# EAGLE design MF_badge_2021_rev_D (EAGLE 9.6.2)
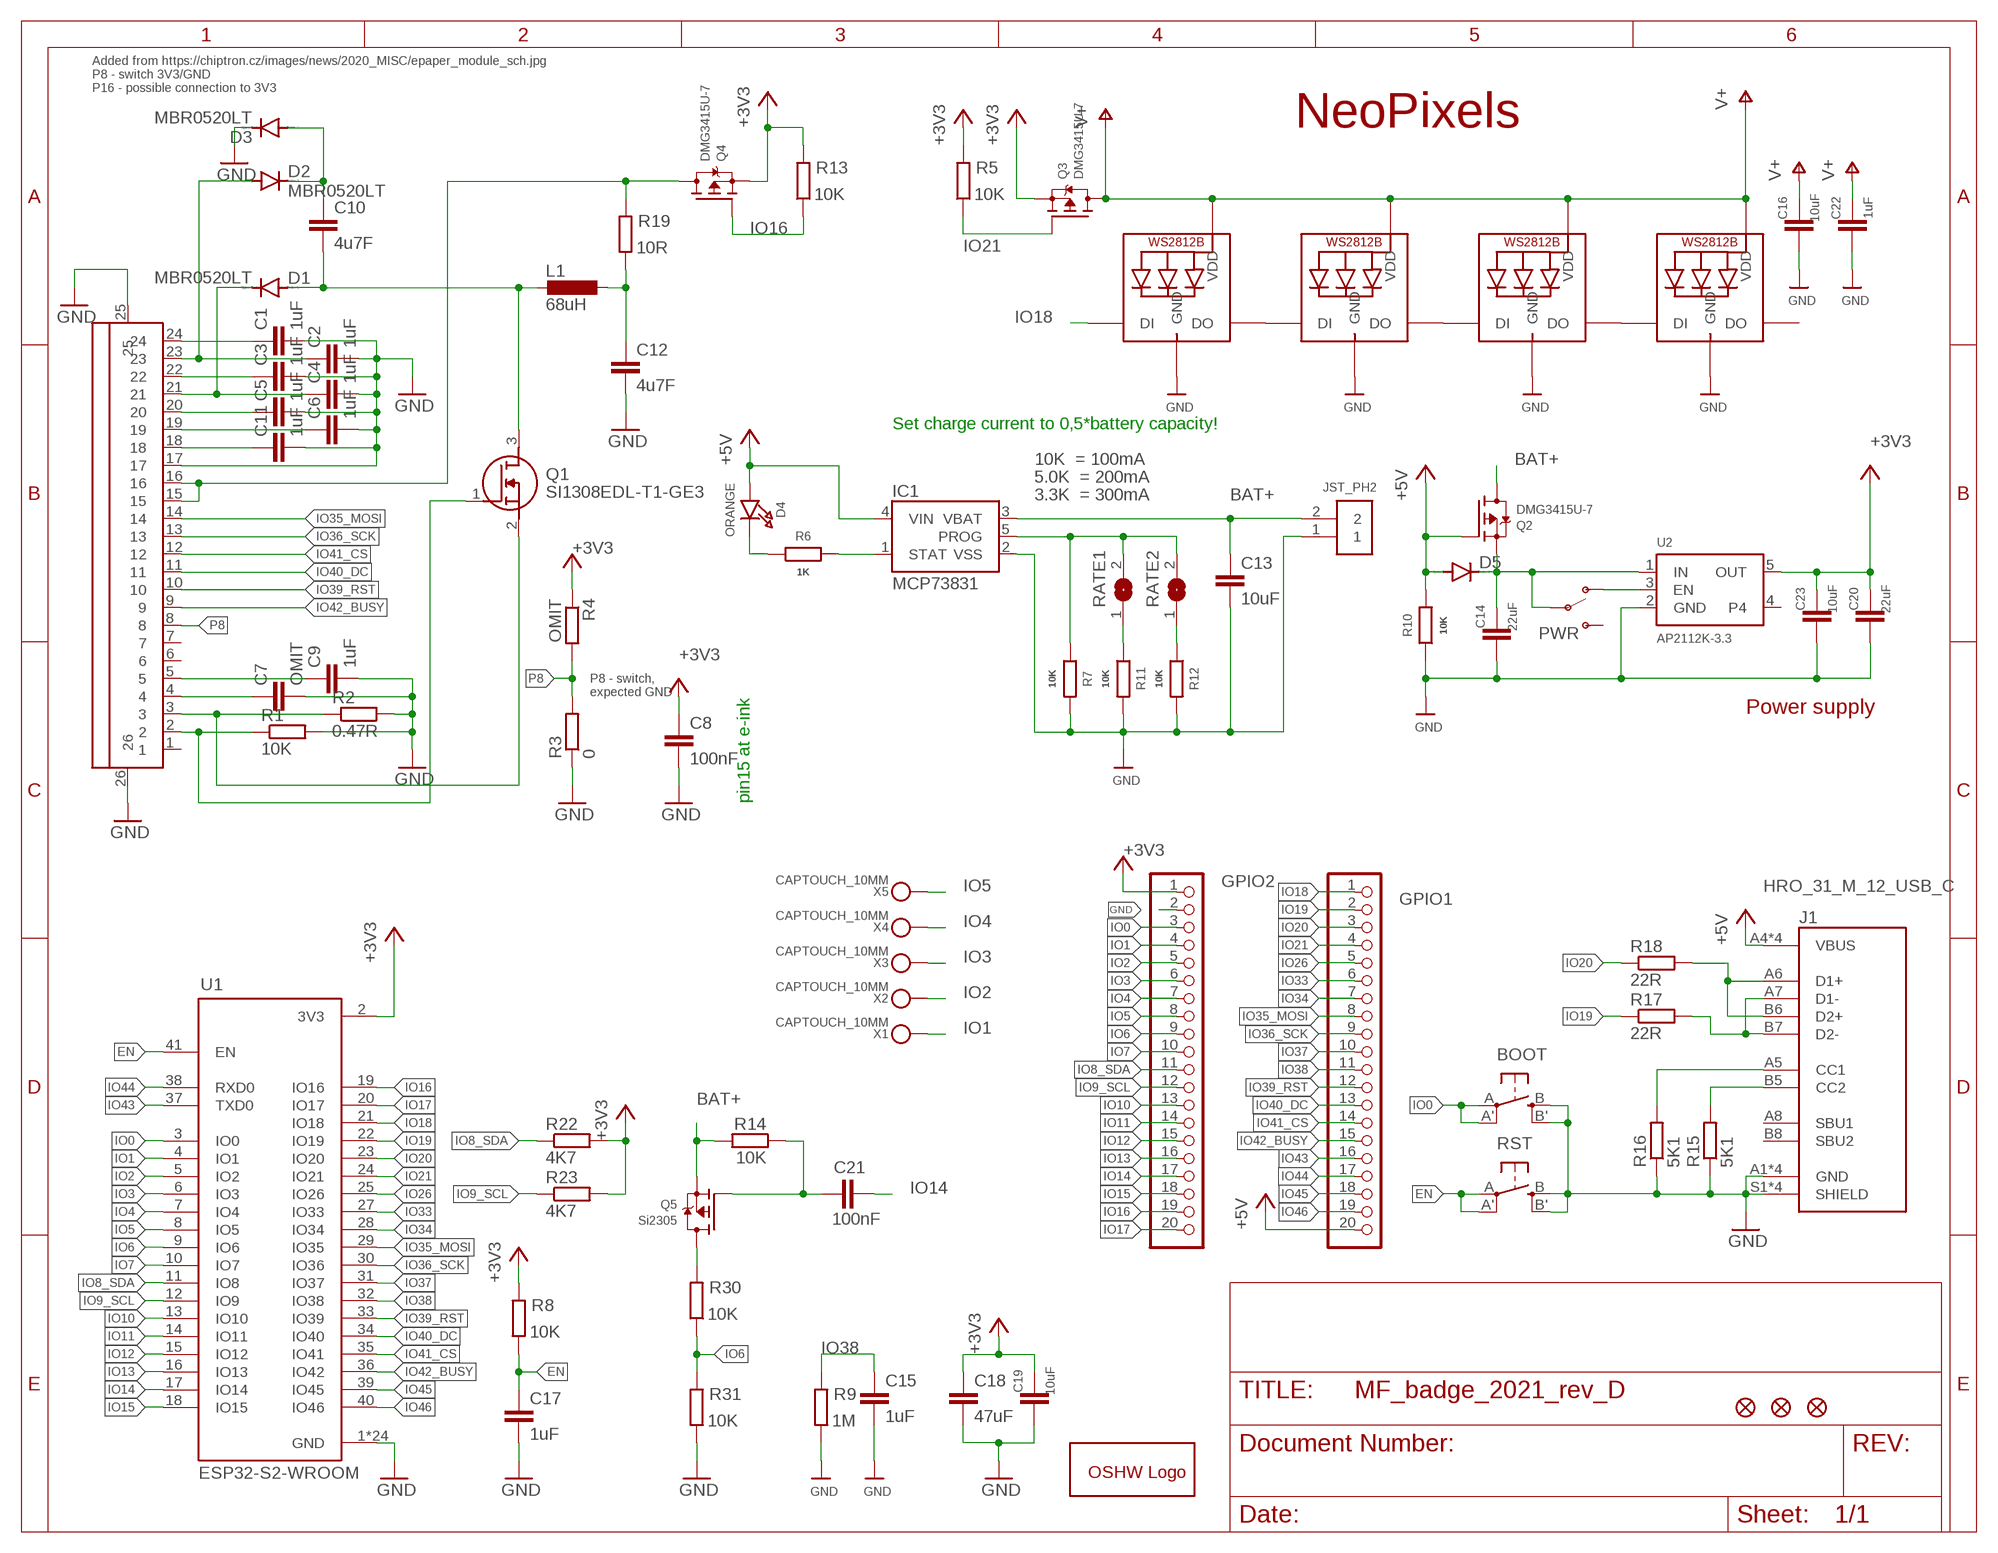
[diagram p0: schematic, sheet 1]

## Parts
BOOT  BUTTON_KMR2_4.6X2.8  [BUTTON_KMR2_4.6X2.8]
C1  1uF  C-EUC0805  [C0805]
C2  1uF  C-EUC0805  [C0805]
C3  1uF  C-EUC0805  [C0805]
C4  1uF  C-EUC0805  [C0805]
C5  1uF  C-EUC0805  [C0805]
C6  1uF  C-EUC0805  [C0805]
C7  OMIT  C-EUC0805  [C0805]
C8  100nF  C-EUC0805  [C0805]
C9  1uF  C-EUC0805  [C0805]
C10  4u7F  C-EUC0805  [C0805]
C11  1uF  C-EUC0805  [C0805]
C12  4u7F  C-EUC0805  [C0805]
C13  10uF  C-EUC0805  [C0805]
C14  22uF  C-EUC0805  [C0805]
C15  1uF  C-EUC0805  [C0805]
C16  10uF  C-EUC0805  [C0805]
C17  1uF  C-EUC0805  [C0805]
C18  47uF  C-EUC0805  [C0805]
C19  10uF  C-EUC0805  [C0805]
C20  22uF  C-EUC0805  [C0805]
C21  100nF  C-EUC0805  [C0805]
C22  1uF  C-EUC0805  [C0805]
C23  10uF  C-EUC0805  [C0805]
D1  MBR0520LT  [SOD123]
D2  MBR0520LT  [SOD123]
D3  MBR0520LT  [SOD123]
D4  ORANGE  LED0805_NOOUTLINE  [CHIPLED_0805_NOOUTLINE]
D5  MBR0520LT  [SOD123]
FID1  FIDUCIAL""  [FIDUCIAL_1MM]
FID2  FIDUCIAL""  [FIDUCIAL_1MM]
FID3  FIDUCIAL""  [FIDUCIAL_1MM]
GOLD_ORB_SM1  OSHWLOGO_  [OSHW_5MM_LOGO]
GPIO1  PINHD-1X20  [1X20]
GPIO2  PINHD-1X20  [1X20]
IC1  MCP73831  [SOT95P290X120-5]
J1  HRO_31_M_12_USB_C  [HRO_31_M_12_USB_C]
L1  68uH  L-EUL4532P  [L4532P]
LED2  WS2812B5050  [WS2812B]
LED3  WS2812B5050  [WS2812B]
LED4  WS2812B5050  [WS2812B]
LED5  WS2812B5050  [WS2812B]
PWR  SWITCH-SPDT-SMD-RIGHT-ANGLE  [SWITCH_SPST_SMD_A]
Q1  SI1308EDL-T1-GE3  [SOT65P210X110-3N]
Q2  DMG3415U-7  MOSFET-P  [SOT23-R]
Q3  DMG3415U-7  MOSFET-P  [SOT23-R]
Q4  DMG3415U-7  MOSFET-P  [SOT23-R]
Q5  Si2305  MOSFET-P  [SOT23-R]
R1  10K  R-EU_R0805  [R0805]
R2  0.47R  R-EU_R0805  [R0805]
R3  0  R-EU_R0805  [R0805]
R4  OMIT  R-EU_R0805  [R0805]
R5  10K  R-EU_R0805  [R0805]
R6  1K  R-EU_R0805  [R0805]
R7  10K  R-EU_R0805  [R0805]
R8  10K  R-EU_R0805  [R0805]
R9  1M  R-EU_R0805  [R0805]
R10  10K  R-EU_R0805  [R0805]
R11  10K  R-EU_R0805  [R0805]
R12  10K  R-EU_R0805  [R0805]
R13  10K  R-EU_R0805  [R0805]
R14  10K  R-EU_R0805  [R0805]
R15  5K1  R-EU_R0805  [R0805]
R16  5K1  R-EU_R0805  [R0805]
R17  22R  R-EU_R0805  [R0805]
R18  22R  R-EU_R0805  [R0805]
R19  10R  R-EU_R0805  [R0805]
R22  4K7  R-EU_R0805  [R0805]
R23  4K7  R-EU_R0805  [R0805]
R30  10K  R-EU_R0805  [R0805]
R31  10K  R-EU_R0805  [R0805]
RATE1  SOLDERJUMPER  [SOLDERJUMPER_ARROW_NOPASTE]
RATE2  SOLDERJUMPER  [SOLDERJUMPER_ARROW_NOPASTE]
RST  BUTTON_KMR2_4.6X2.8  [BUTTON_KMR2_4.6X2.8]
U1  ESP32-S2-WROOM  [XCVR_ESP32-S2-WROOM]
U2  AP2112K-3.3  VREG_SOT23-5  [SOT23-5]
U$1  2.13_EINK  [2.13_EINK]
U$8  JST_PH2  [JSTPH2]
X1  CAPTOUCH_10MM  CAPTOUCH_MONOPAD_6X9  [CAPTOUCH_6X9MM]
X2  CAPTOUCH_10MM  CAPTOUCH_MONOPAD_6X9  [CAPTOUCH_6X9MM]
X3  CAPTOUCH_10MM  CAPTOUCH_MONOPAD_6X9  [CAPTOUCH_6X9MM]
X4  CAPTOUCH_10MM  CAPTOUCH_MONOPAD_6X9  [CAPTOUCH_6X9MM]
X5  CAPTOUCH_10MM  CAPTOUCH_MONOPAD_6X9  [CAPTOUCH_6X9MM]

## Nets
+3V3 [power]: C8.1 C18.1 C19.1 C20.1 C23.1 GPIO2.1 Q3.2(S) Q4.2(S) R4.1 R5.2 R8.2 R13.2 R22.2 R23.2 U1.2(3V3) U2.5(OUT)
+5V: D4.A D5.A GPIO1.20 IC1.4(VIN) J1.A4(VBUS) J1.A9(VBUS) J1.B4(VBUS) J1.B9(VBUS) Q2.1(G) R10.2
BAT+: C13.1 IC1.3(VBAT) Q2.3(D) Q5.2(S) R14.2 U$8.2
D+_CON: J1.A6(D1+) J1.B6(D2+) R18.2
D-_CON: J1.A7(D1-) J1.B7(D2-) R17.2
EN: C17.1 R8.1 RST.A'(P1) RST.A(P) U1.41(EN)
GND: BOOT.B'(S1) BOOT.B(S) C1.2 C2.2 C3.2 C4.2 C5.2 C6.2 C7.2 C8.2 C9.2 C11.2 C12.2 C13.2 C14.2 C15.2 C16.2 C17.2 C18.2 C19.2 C20.2 C22.2 C23.2 D3.C GPIO2.2 IC1.2(VSS) J1.A1(GND) J1.A12(GND) J1.B1(GND) J1.B12(GND) J1.S1(SHIELD) J1.S2(SHIELD) J1.S3(SHIELD) J1.S4(SHIELD) LED2.3-GND(GND) LED3.3-GND(GND) LED4.3-GND(GND) LED5.3-GND(GND) R1.2 R2.2 R3.1 R7.2 R9.1 R10.1 R11.2 R12.2 R15.1 R16.1 R31.1 RST.B'(S1) RST.B(S) U1.1(GND) U1.26(GND) U1.42(GND) U1.43.1(GND) U1.43.2(GND) U1.43.3(GND) U1.43.4(GND) U1.43.5(GND) U1.43.6(GND) U1.43.7(GND) U1.43.8(GND) U1.43.9(GND) U1.43.10(GND) U1.43.11(GND) U1.43.12(GND) U1.43.13(GND) U1.43.14(GND) U1.43.15(GND) U1.43.16(GND) U1.43.17(GND) U1.43.18(GND) U1.43.19(GND) U1.43.20(GND) U1.43.21(GND) U2.2(GND) U$1.17 U$1.25 U$1.26 U$8.1
IO0: BOOT.A'(P1) BOOT.A(P) GPIO2.3 U1.3(IO0)
IO1: GPIO2.4 U1.4(IO1) X1.P$1
IO2: GPIO2.5 U1.5(IO2) X2.P$1
IO3: GPIO2.6 U1.6(IO3) X3.P$1
IO4: GPIO2.7 U1.7(IO4) X4.P$1
IO5: GPIO2.8 U1.8(IO5) X5.P$1
IO6: GPIO2.9 R30.1 R31.2 U1.9(IO6)
IO7: GPIO2.10 U1.10(IO7)
IO8_SDA: GPIO2.11 R22.1 U1.11(IO8)
IO9_SCL: GPIO2.12 R23.1 U1.12(IO9)
IO10: GPIO2.13 U1.13(IO10)
IO11: GPIO2.14 U1.14(IO11)
IO12: GPIO2.15 U1.15(IO12)
IO13: GPIO2.16 U1.16(IO13)
IO14: C21.2 GPIO2.17 U1.17(IO14)
IO15: GPIO2.18 U1.18(IO15)
IO16: GPIO2.19 Q4.1(G) R13.1 U1.19(IO16)
IO17: GPIO2.20 U1.20(IO17)
IO18: GPIO1.1 LED2.4-DIN(DI) U1.21(IO18)
IO19: GPIO1.2 R17.1 U1.22(IO19)
IO20: GPIO1.3 R18.1 U1.23(IO20)
IO21: GPIO1.4 Q3.1(G) R5.1 U1.24(IO21)
IO26: GPIO1.5 U1.25(IO26)
IO33: GPIO1.6 U1.27(IO33)
IO34: GPIO1.7 U1.28(IO34)
IO35_MOSI: GPIO1.8 U1.29(IO35) U$1.14
IO36_SCK: GPIO1.9 U1.30(IO36) U$1.13
IO37: GPIO1.10 U1.31(IO37)
IO38: C15.1 GPIO1.11 R9.2 U1.32(IO38)
IO39_RST: GPIO1.12 U1.33(IO39) U$1.10
IO40_DC: GPIO1.13 U1.34(IO40) U$1.11
IO41_CS: GPIO1.14 U1.35(IO41) U$1.12
IO42_BUSY: GPIO1.15 U1.36(IO42) U$1.9
IO43: GPIO1.16 U1.37(TXD0)
IO44: GPIO1.17 U1.38(RXD0)
IO45: GPIO1.18 U1.39(IO45)
IO46: GPIO1.19 U1.40(IO46)
N$1: C1.1 U$1.24
N$2: C2.1 D2.A U$1.23
N$3: C3.1 U$1.22
N$4: C4.1 D1.C U$1.21
N$5: C5.1 U$1.20
N$6: C6.1 U$1.19
N$7: C11.1 U$1.18
N$8: IC1.1(STAT) R6.2
N$9: C14.1 D5.C PWR.2(P) Q2.2(S) U2.1(IN)
N$10: Q1.2(S) R2.1 U$1.3
N$11: C9.1 U$1.5
N$12: C7.1 U$1.4
N$13: Q1.1(G) R1.1 U$1.2
N$15: D4.C R6.1
N$16: C10.1 D2.C D3.A
N$17: LED2.2-DOUT(DO) LED3.4-DIN(DI)
N$18: PWR.1(O) U2.3(EN)
N$19: C10.2 D1.A L1.2 Q1.3(D)
N$20: R11.1 RATE1.1
N$21: R12.1 RATE2.1
N$22: LED4.2-DOUT(DO) LED5.4-DIN(DI)
N$23: J1.B5(CC2) R15.2
N$24: J1.A5(CC1) R16.2
N$25: LED3.2-DOUT(DO) LED4.4-DIN(DI)
N$27 [power]: Q4.3(D) R19.2 U$1.15 U$1.16
N$78 [power]: C12.1 L1.1 R19.1
N$79: Q5.3(D) R30.2
N$80: C21.1 Q5.1(G) R14.1
P8: R3.2 R4.2 U$1.8
PROG: IC1.5(PROG) R7.1 RATE1.2 RATE2.2
V+: C16.1 C22.1 LED2.1-VDD(VDD) LED3.1-VDD(VDD) LED4.1-VDD(VDD) LED5.1-VDD(VDD) Q3.3(D)
Unconnected: J1.A8(SBU1) J1.B8(SBU2) LED5.2-DOUT(DO) PWR.3(S) U2.4 U$1.1 U$1.6 U$1.7

## Notes on the sheet
- Added from https://chiptron.cz/images/news/2020_MISC/epaper_module_sch.jpg
  P8 - switch 3V3/GND
  P16 - possible connection to 3V3
- NeoPixels
- Set charge current to 0,5*battery capacity!
- 10K  = 100mA
- 5.0K  = 200mA
- 3.3K  = 300mA
- P8 - switch,
  expected GND
- Power supply
- pin15 at e-ink

## Library data of the parts
BOOT RST = dronecz:BUTTON_KMR2_4.6X2.8: SMT Tact Switches 6x6mm - Digikey: P12940SCT-ND KMR2 (4.6x2.8mm) - Digikey: 401-1426-1-ND EVQ-PQHB55 - Light Touch, 160GF (4.5x4.5mm) - Digikey: P8090SCT-ND Farnell (KMR221NG) - 2845727
C1-C23 = rcl:C-EU: CAPACITOR, European symbol; SPICEPREFIX: C
D1-D3 D5 = diode:MBR0520LT: SCHOTTKY BARRIER RECTIFIER Source: http://onsemi.com .. MBR0520LT1-D.pdf
D4 = microbuilder:LED: LED 0603 - 0603 Surface Mount Package 2mA: Green LED - Low Power (3.9mcd, 2ma, 1.7Vf) - Digikey: 475-2709-2-ND Orange LED - Low Power (9.8mcd, 2ma, 1.8Vf) - Digikey: 475-1194-2-ND Red LED - Low Power (5mcd, 2ma, 1.8Vf) - Digikey: 475-1195-2-ND Yellow LED - Low Power (7mcd, 2ma, 1.8Vf) - Digikey: 475-1196-2-ND 5mA: Blue LED - Low Power (17mcd, 5ma, 2.9Vf) - Digikey: LNJ937W8CRACT-ND 0805 - 0805 Surface Mount Package 2mA: Red LED (8.8mcd, 2mA, 1.8Vf, Clear) - Low Power [Digikey: 475-2510-1-ND] Green LED (5mcd, 2mA, 1.8Vf, Clear) - Low Power [Digikey: 475-2730-1-ND] Yellow LED (11.3mcd, 2mA, 1.8Vf, Clear) - Low Power [Digikey: 475-2555-1-ND] 20mA: Red LED (104mcd, 20mA, Diffused) - LS R976 [Digikey: 475-1278-6-ND] Red LED (12mcd, 20mA, 2.0Vf, Clear) - APT2012EC [Digikey: 754-1128-1-ND] Green LED (15mcd, 20mA, 2.2Vf, Clear) - APT2012GC [Digikey: 754-1131-1-ND] Orange LED (160mcd, 20mA, 2.1Vf, Clear) - APT2012SECK [Digikey: 754-1130-1-ND] 1206 - 1206 Surface Mount Package Green LED (26mcd, 20mA, Diffused) - LG N971 [Digikey: 475-1407-6-ND] Red LED (15mcd, 20mA, Diffused) - LH N974 [Digikey: 475-1416-6-ND]
FID1-FID3 = microbuilder:FIDUCIAL: Fiducial Alignment Points Various fiducial points for machine vision alignment.
GOLD_ORB_SM1 = oshw:OSHWLOGO: The OSHW logo for PCB layout
GPIO1 GPIO2 = pinhead:PINHD-1X20: PIN HEADER
IC1 = Bastlir:MCP73831
J1 = Bastlir:HRO_31_M_12_USB_C: USB Shielded I/O Receptacle; Type C; Right Angle; Surface Mount; Gold over Nickel
L1 = rcl:L-EU: INDUCTOR, European symbol; SPICEPREFIX: L
LED2-LED5 = microbuilder:WS2812B
PWR = dronecz:SWITCH-SPDT: Single Pole, Double Throw (SPDT) Switch Single-pole, double-throw (SPDT) switch. Variant Overview SMD-AYZ0202 Surface Mount DPDT Switch <https://www.sparkfun.com/products/597> (COM-00597) Used on e.g. LilyPad Arduino USB - ATmega32U4 Board <https://www.sparkfun.com/products/12049> PTH-11.6X4.0MM SPDT Mini Power Switch <https://www.sparkfun.com/products/102> (COM-00102) Used on e.g. SparkFun Simon Says - Through-Hole Soldering Kit <https://www.sparkfun.com/products/10547> (KIT-10547) PTH-11.6X4.0MM-KIT KIT version of SPDT Mini Power Switch - Simplifies soldering by removing tStop of switch pins - only one side can be soldered. PTH-11.6X4.0MM-LOCK LOCK version of SPDT Mini Power Switch - Offset pins hold switch in place for easier soldering. SMD-RIGHT-ANGLE Surface Mount Right Angle Switch <https://www.sparkfun.com/products/10860> (COM-10860) Used on e.g. SparkFun ESP8266 Thing <https://www.sparkfun.com/products/13231>; PROD_ID: SWCH-10651; SF_SKU: COM-10860
Q1 = SamacSys_Parts:SI1308EDL-T1-GE3: MOSFET N-Ch 30V 1.5A TrenchFET SC70 Vishay Si1308EDL-T1-GE3 N-channel MOSFET Transistor, 1.5 A, 30 V, 3-Pin SC-70 Source: Datasheet <https://componentsearchengine.com/Datasheets/1/SI1308EDL-T1-GE3.pdf>; DESCRIPTION: MOSFET N-Ch 30V 1.5A TrenchFET SC70 Vishay Si1308EDL-T1-GE3 N-channel MOSFET Transistor, 1.5 A, 30 V, 3-Pin SC-70; HEIGHT: 1.1mm; MANUFACTURER_NAME: Vishay; MANUFACTURER_PART_NUMBER: Si1308EDL-T1-GE3; MOUSER_PART_NUMBER: 78-SI1308EDL-T1-GE3; MOUSER_PRICE-STOCK: https://www.mouser.co.uk/ProductDetail/Vishay-Semiconductors/SI1308EDL-T1-GE3?qs=bX1%252BNvsK%2FBramh9tgpOaEw%3D%3D
Q2-Q5 = microbuilder:MOSFET-P: P-Channel Mosfet LEGEND VDS: Voltage Drain-Source ID: Drain Current RDS(ON): Drain-Source On-State Resistance VGS(TH): Gate-Source Threshold Voltage CISS: Drain-Source Input Capacitance SOT-23 Name VDS ID RDS(ON) VGS(TH) CISS Order Number IRLML5103 30V 760mA 600 mOhm -- 75pF @ 25V Digikey: IRLML5103PBFCT-ND IRLML6401 12V 4.3A 50 mOhm 950mV @ 250µA 830pF @ 10V Digikey: IRLML6401PBFTR-ND NTR0202PL 20V 400mA 800 mOhm 2.3V @ 250uA 70pF @ 5V Digikey: NTR0202PLT1GOSTR-ND NTR4101PT1G 20V 1.8A 85 mOhm 1.2V @ 250uA 675pF @ 10V Digikey: NTR4101PT1GOSCT-ND DMP2004K 20V 600mA 900 mOhm 1V @ 250uA 175pF @ 16V Digikey: DMP2004KDICT-ND PMV65XP 20V 3.9A 76 mOhm 950mV @ 1mA 725pF @ 20V Digikey: 568-2358-2-ND TO-252 Name VDS ID RDS(ON) VGS(TH) CISS Order Number AOD417 30V 25A 34 mOhm 3V @ 250µA 920pF @ 15V Digikey: 785-1106-2-ND
R1-R19 R22 R23 R30 R31 = rcl:R-EU_: RESISTOR, European symbol; SPICEPREFIX: R
RATE1 RATE2 = microbuilder:SOLDERJUMPER: SMD Solder JUMPER Solder the two pads together to create a connection, or remove the solder to break it. REFLOW - Use this footprint for solder paste and reflow ovens. WAVE - Use this footprint for hand-soldering (larger pads). CLOSED - Has a trace between the two pads to ensure it is closed by default. The trace needs to be cut to disable the jumper, and can be closed again by creating a solder bridge between the two pads.; BOM: EXCLUDE
U1 = Bastlir:ESP32-S2-WROOM: WiFi 802.11b/g/n Transceiver Module 2.4GHz PCB Trace Surface Mount Check prices <https://pricing.snapeda.com/search/part/ESP32-S2-WROOM/?ref=eda>; AVAILABILITY: Bad; DESCRIPTION: WiFi 802.11b/g/n Transceiver Module 2.4GHz PCB Trace Surface Mount; MF: Espressif Systems; MP: ESP32-S2-WROOM; PACKAGE: VFQFN-56 Espressif Systems; PRICE: None
U2 = microbuilder:VREG_SOT23-5: SOT23-5 Fixed Voltage Regulators To better organise some of the SOT23-5 fixed voltage regulators in this library, this new part was created. Part Current Out V Out V In V Dropout Digikey Part No. ADP121 150mA 3.3V 3.4-5.5V 0.09V @ 150mA ADP121-AUJZ33R7CT-ND ADP121 150mA 3.0V 3.1-5.5V 0.09V @ 150mA ADP121-AUJZ30R7CT-ND ADP122 300mA 3.3V 3.4-5.5V 0.085V @ 300mA ADP122AUJZ-3.3-R7CT-ND ADP1712 300mA 3.3V 3.5-5.5V 0.17V @ 300mA ADP1712AUJZ-3.3-R7TR-ND AP7311 (Low Cost) 150mA 3.3V 3.5-6V 0.15V @ 150mA AP7311-33WG-7DICT-ND LD39015M18R 150mA 1.8V 1.9V-5.5V 0.08V @ 100mA 497-6977-1-ND MCP1824T-3302E/OT 300mA 3.3V 3.5V-6V 0.2V @ 300mA MCP1824T-3302E/OTCT-ND MIC5205-2.5YM5 TR 150mA 2.5V 2.7-16V 0.165V @ 150mA 576-1257-2-ND MIC5205-3.0YM5 TR 150mA 3.0V 3.2V-16V 0.165V @ 150mA 576-1258-2-ND MIC5205-3.3YM5 TR 150mA 3.3V 3.5V-16V 0.165V @ 150mA 576-1259-2-ND TPS780330220 150mA 3.3V+2.2V 3.6-5.5V 250mV Max 296-23332-1-ND TDA3663/N1,135 100mA 3.3V 3.5-45V 0.18V @ 50mA 568-5343-1-ND
U$1 = dronecz:2.13_EINK
U$8 = Bastlir:JST_PH2
X1-X5 = adafruit_electromech:CAPTOUCH_MONOPAD

## Net classes
1 power: width 0.508 mm
2 lowpower: width 0.305 mm, drill 0.483 mm

## Board
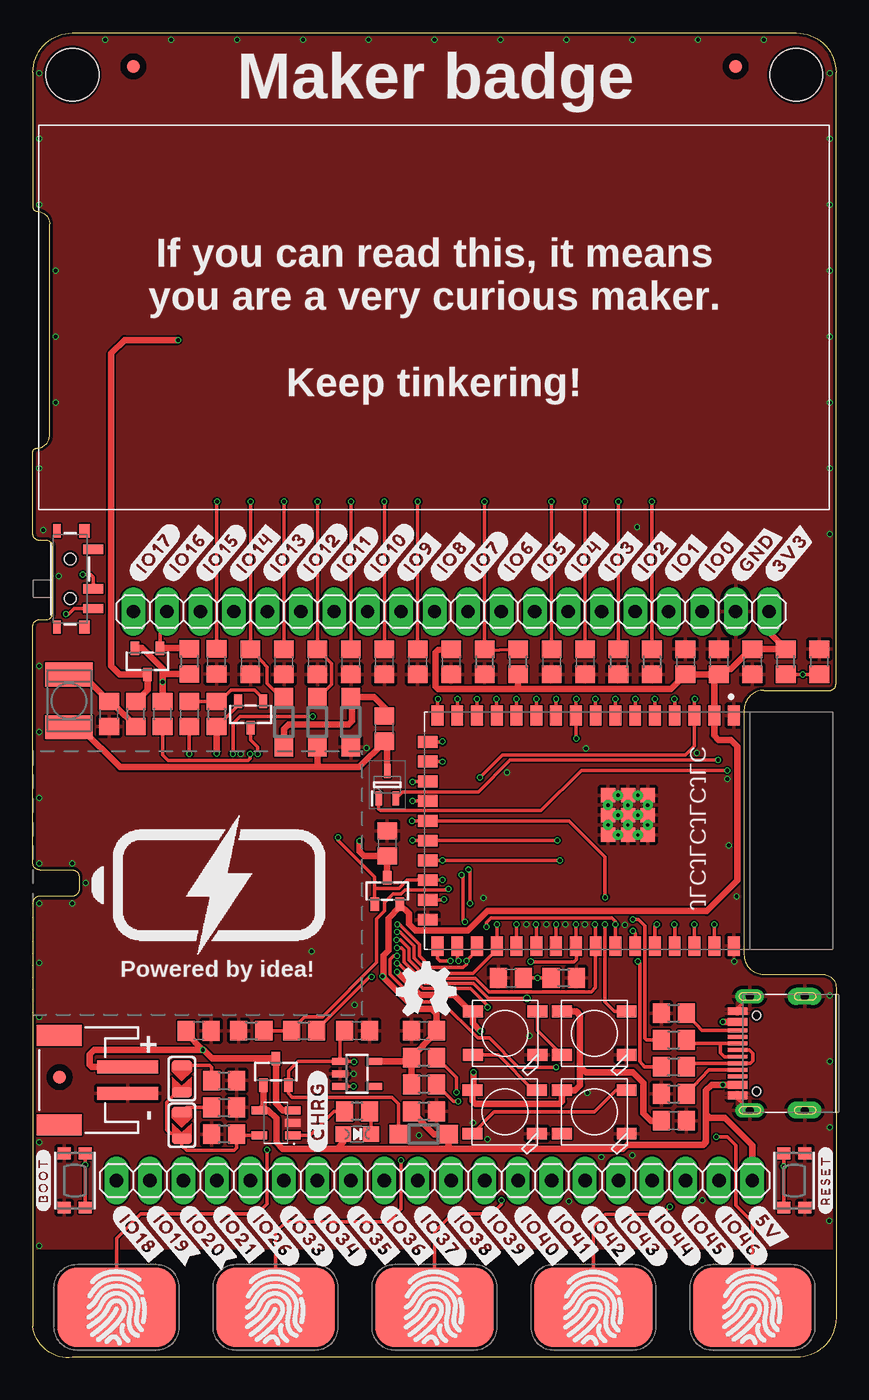
[diagram p1: board, top side]
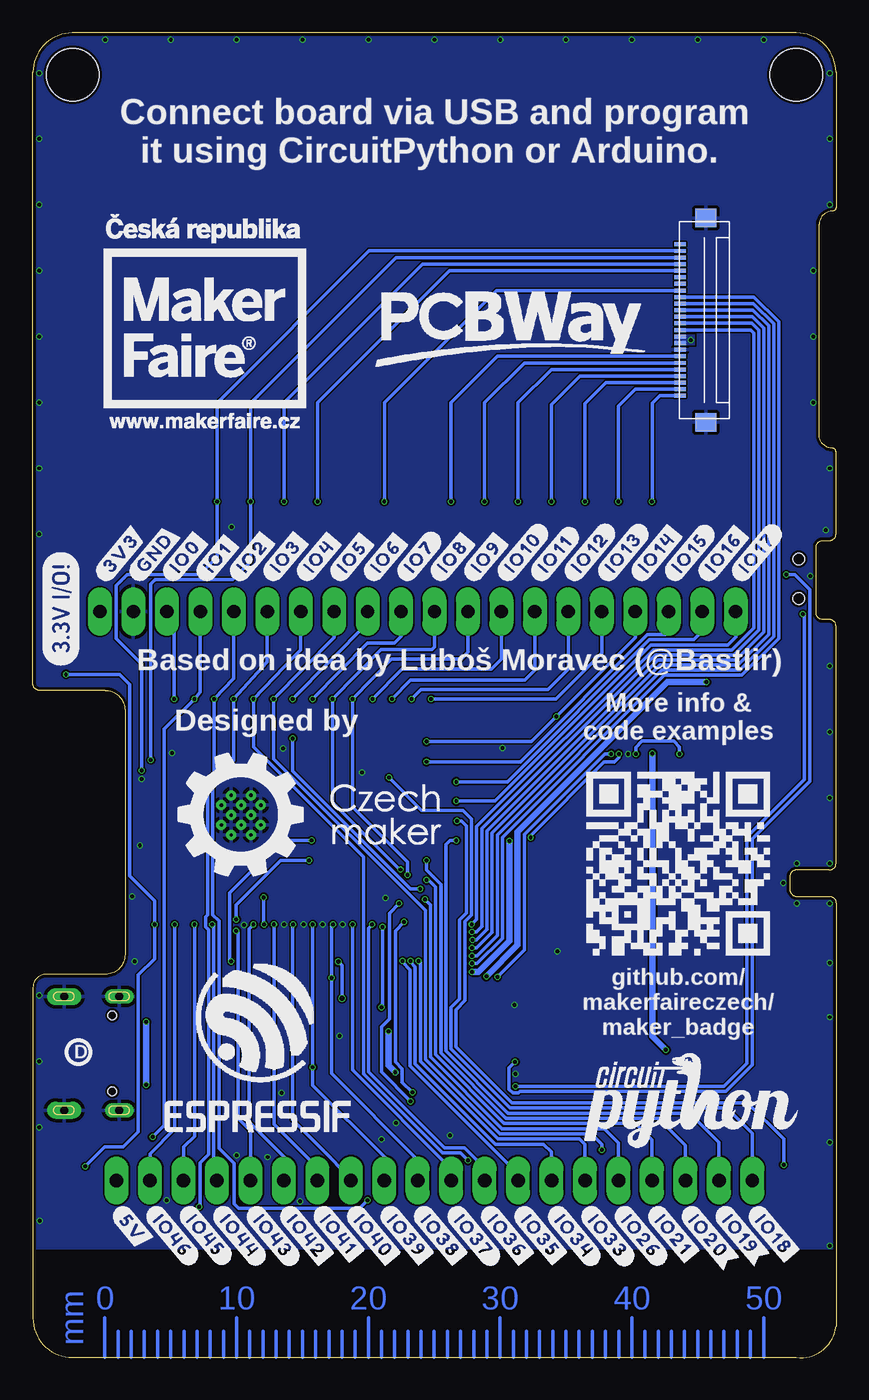
[diagram p2: board, bottom side, seen from below]

Size 60.96 x 100.54 mm. Coordinates in mm from the lower left corner, seen from the top.
Outline: 53.98,49.14 53.98,30.59 arc90 55.48,29.09 59.96,29.09 arc-90 60.96,28.09 60.96,3.02 arc-90 57.96,0.02 3,0.02 arc-90 0,2.38 0,34.52 arc-90 0.5,35.02 3,35.02 arc90 3.5,35.52 3.5,36.52 arc90 3,37.02 0.5,37.02 arc-90 0,37.52 0,55.52 arc-90 0.5,56.02 1,56.02 arc90 1.5,56.52 1.5,61.52 arc90 1,62.02 0.5,62.02 arc-90 0,62.52 0,68.75 arc-90 0.27,69.02 arc90 1.27,70.02 1.27,86.02 arc90 0.27,87.02 arc-90 0,87.29 0,97.54 arc-90 3,100.54 57.96,100.54 arc-90 60.96,97.54 60.96,51.14 arc-90 60.46,50.64 55.48,50.64 arc90 53.98,49.14
Copper layers (1*16): Top 0.035mm / dielectric 1.6mm / Bottom 0.035mm
Design rules "jlcpcb2layer *": minimum track width 5mil, minimum drill 0.3mm, track to track 5mil, track to pad 5mil, pad to pad 5mil, via to via 5mil, smd to smd 5mil, copper to edge 0.2mm, drill to drill 6mil, minimum pad ring 10mil, minimum via ring 3mil, stop-mask expansion 4mil, vias tented up to drill 0mil, thermal gap 10mil
Holes 4 mm at 57.95,97.36 3,97.36
tRestrict: area 0,0 to 61,8.2
bRestrict: area 0,0 to 60.9,8.2

### Footprints (pad centres in the part's own frame; a part is rotated, then mirrored left to right if it is on the bottom)
BUTTON_KMR2_4.6X2.8 = smd 0.9 x 1: A 2.05,0.8; A' -2.05,0.8; B 2.05,-0.8; B' -2.05,-0.8
C0805 = smd 1.3 x 1.5: 1 -0.95,0; 2 0.95,0
SOD123 = smd 1.4 x 1.4: A 1.9,0; C -1.9,0
CHIPLED_0805_NOOUTLINE = smd 1.2 x 1.2: A 0,-1.05; C 0,1.05
FIDUCIAL_1MM = smd 1 x 1: 1 0,0
1X20 = drill 1.016 long: 1 -24.13,0; 2 -21.59,0; 3 -19.05,0; 4 -16.51,0; 5 -13.97,0; 6 -11.43,0; 7 -8.89,0; 8 -6.35,0; 9 -3.81,0; 10 -1.27,0; 11 1.27,0; 12 3.81,0; 13 6.35,0; 14 8.89,0; 15 11.43,0; 16 13.97,0; 17 16.51,0; 18 19.05,0; 19 21.59,0; 20 24.13,0
SOT95P290X120-5 = smd 1.18 x 0.609: 1 -1.274,0.95; 2 -1.274,0; 3 -1.274,-0.95; 4 1.274,-0.95; 5 1.274,0.95
HRO_31_M_12_USB_C = smd 0.3 x 1.45: A1 -3.35,4.045; A4 -2.55,4.045; A5 -1.25,4.045; A6 -0.25,4.045; A7 0.25,4.045; A8 1.25,4.045; A9 2.55,4.045; A12 3.35,4.045; B1 3.05,4.045; B4 2.25,4.045; B5 1.75,4.045; B6 0.75,4.045; B7 -0.75,4.045; B8 -1.75,4.045; B9 -2.25,4.045; B12 -3.05,4.045 | drill 0.6 pad 1.1 long: S1 -4.32,3.13; S2 4.32,3.13 | drill 0.6 pad 1.3 long: S3 -4.32,-1.05; S4 4.32,-1.05 | hole 0.65: -2.89,2.6; 2.89,2.6
L4532P = smd 1.8 x 3.6: 1 -2,0; 2 2,0
WS2812B = smd 1.5 x 0.9: 1-VDD 2.45,-1.65; 2-DOUT 2.45,1.65; 3-GND -2.45,1.65; 4-DIN -2.45,-1.65
SWITCH_SPST_SMD_A = smd 0.7 x 1.5: 1 -2.25,-1.75; 2 -0.75,-1.75; 3 2.25,-1.75 | smd 1 x 0.6: GND -3.65,1; GND@3 3.65,1 | smd 1 x 0.8: GND@1 -3.65,-1.1; GND@4 3.65,-1.1 | hole 0.9: -1.5,0; 1.5,0
SOT65P210X110-3N = smd 1.05 x 0.5: 1 -1.05,0.65; 2 -1.05,-0.65; 3 1.05,0
SOT23-R = smd 0.635 x 1.016: 1 -0.95,-1; 2 0.95,-1; 3 0,1
R0805 = smd 1.3 x 1.5: 1 -0.95,0; 2 0.95,0
SOLDERJUMPER_ARROW_NOPASTE = smd 0.762 x 1.524: 1 -1.016,0; 2 1.016,0
XCVR_ESP32-S2-WROOM = smd 1.5 x 0.9: 1 -8.75,8; 2 -8.75,6.5; 3 -8.75,5; 4 -8.75,3.5; 5 -8.75,2; 6 -8.75,0.5; 7 -8.75,-1; 8 -8.75,-2.5; 9 -8.75,-4; 10 -8.75,-5.5; 11 -8.75,-7; 12 -8.75,-8.5; 13 -8.75,-10; 14 -8.75,-11.5; 15 -8.75,-13; 16 -8.75,-14.5; 27 8.75,-14.5; 28 8.75,-13; 29 8.75,-11.5; 30 8.75,-10; 31 8.75,-8.5; 32 8.75,-7; 33 8.75,-5.5; 34 8.75,-4; 35 8.75,-2.5; 36 8.75,-1; 37 8.75,0.5; 38 8.75,2; 39 8.75,3.5; 40 8.75,5; 41 8.75,6.5; 42 8.75,8 | smd 0.9 x 1.5: 17 -6.75,-15.25; 18 -5.25,-15.25; 19 -3.75,-15.25; 20 -2.25,-15.25; 21 -0.75,-15.25; 22 0.75,-15.25; 23 2.25,-15.25; 24 3.75,-15.25; 25 5.25,-15.25; 26 6.75,-15.25 | smd 1.1 x 1.1: 43.1 -1.19,-0.05; 43.2 -2.69,-0.05; 43.3 0.31,-0.05; 43.4 -2.69,-1.55; 43.5 -1.19,-1.55; 43.6 0.31,-1.55; 43.7 -2.69,1.45; 43.8 -1.19,1.45; 43.9 0.31,1.45 | drill 0.25 pad 0.4: 43.10 -1.19,0.7; 43.11 -2.69,0.7; 43.12 0.31,0.7; 43.13 -2.69,-0.8; 43.14 -1.19,-0.8; 43.15 0.31,-0.8; 43.16 -1.94,1.45; 43.17 -0.44,1.45; 43.18 -1.94,-0.05; 43.19 -0.44,-0.05; 43.20 -1.94,-1.55; 43.21 -0.44,-1.55
SOT23-5 = smd 0.55 x 1.2: 1 -0.95,-1.3; 2 0,-1.3; 3 0.95,-1.3; 4 0.95,1.3; 5 -0.95,1.3
2.13_EINK = smd 0.9 x 0.3 bottom: 1 -18.6,5.55; 2 -18.6,5.05; 3 -18.6,4.55; 4 -18.6,4.05; 5 -18.6,3.55; 6 -18.6,3.05; 7 -18.6,2.55; 8 -18.6,2.05; 9 -18.6,1.55; 10 -18.6,1.05; 11 -18.6,0.55; 12 -18.6,0.05; 13 -18.6,-0.45; 14 -18.6,-0.95; 15 -18.6,-1.45; 16 -18.6,-1.95; 17 -18.6,-2.45; 18 -18.6,-2.95; 19 -18.6,-3.45; 20 -18.6,-3.95; 21 -18.6,-4.45; 22 -18.6,-4.95; 23 -18.6,-5.45; 24 -18.6,-5.95 | smd 1.6 x 1.4 bottom: 25 -20.55,7.55; 26 -20.55,-7.95
JSTPH2 = smd 1 x 4.6: 1 -1,-3.7; 2 1,-3.7 | smd 1.6 x 3.4: NC1 -3.4,1.5; NC2 3.4,1.5
CAPTOUCH_6X9MM = smd 9 x 6: P$1 0,0

### Placement (x,y rotation side)
BOOT  3.17,13.45 270 top
C1  13.94,52.85 270 top
C2  16.51,52.82 270 top
C3  19.05,52.82 270 top
C4  21.59,52.82 270 top
C5  24.13,52.82 270 top
C6  26.67,52.82 270 top
C7  41.91,52.82 270 top
C8  31.75,52.82 270 top
C9  39.37,52.82 270 top
C10  26.67,47.74 270 top
C11  29.21,52.82 270 top
C12  5.78,48.85 270 top
C13  12.57,24.81 0 top
C14  24.61,24.81 0 top
C15  36.29,28.81 180 top
C16  48.64,17.99 0 top
C17  59.69,52.82 90 top
C18  49.53,52.82 90 top
C19  52.07,52.82 90 top
C20  29.69,24.81 180 top
C21  11.87,48.85 270 top
C22  26.89,39.04 90 top
C23  54.61,52.82 270 top
D1  21.59,48.24 270 top
D2  19.05,48.24 90 top
D3  24.13,48.24 90 top
D4  24.61,16.97 270 top
D5  29.65,16.97 0 top
FID1  53.34,98 0 top
FID2  7.62,98 0 top
FID3  2.02,21.29 0 top
GOLD_ORB_SM1  29.84,27.77 0 top
GPIO1  30.48,13.45 0 top
GPIO2  31.75,56.63 180 top
IC1  18.45,17.83 180 top
J1  57.53,23.1 90 top
L1  2.73,49.85 270 top
LED2  42.61,24.62 180 top
LED3  35.85,24.62 180 top
LED4  35.81,18.65 180 top
LED5  42.61,18.65 180 top
PWR  2.83,59.1 90 top
Q1  26.89,43.48 90 top
Q2  18.45,21.7 0 top
Q3  26.89,35.42 0 top
Q4  8.7,52.85 180 top
Q5  16.52,48.82 180 top
R1  46.99,52.82 270 top
R2  44.45,52.82 270 top
R3  34.29,52.82 90 top
R4  36.83,52.82 90 top
R5  9.84,48.85 90 top
R6  24.61,18.7 180 top
R7  14.51,16.97 180 top
R8  57.15,52.82 90 top
R9  40.29,28.81 180 top
R10  29.69,18.7 180 top
R11  14.51,21.04 0 top
R12  14.51,19 0 top
R13  11.87,52.85 270 top
R14  13.94,48.85 270 top
R15  48.64,26.15 0 top
R16  48.64,20.02 0 top
R17  48.64,22.08 0 top
R18  48.64,24.12 0 top
R19  7.82,48.85 90 top
R22  29.69,20.75 180 top
R23  29.69,22.78 180 top
R30  20.57,24.81 0 top
R31  16.57,24.81 0 top
RATE1  11.3,21.16 270 top
RATE2  11.3,17.64 270 top
RST  57.78,13.45 90 top
U1  45.21,39.99 270 top
U2  24.61,21.54 270 top
U$1  30.44,78.95 0 top
U$2  [#IO43#0]  44.45,11.29 310 top
U$3  [#IO44#0]  46.99,11.29 310 top
U$4  [#IO17#0]  7.62,59.17 50 bottom
U$6  [#IO16#0]  10.16,59.17 50 bottom
U$7  [#BOOT#0]  0.79,13.45 90 top
U$8  3.49,21.07 90 top
U$9  [#RESET#0]  60.17,13.45 90 top
U$10  [PCBFEAT-REV-040]  57.5,23.2 0 bottom
U$12  [#CHRG#0]  21.62,15.67 90 top
U$16  [#IO18#0]  6.35,11.29 310 top
U$17  [#IO19#0]  8.92,11.29 310 top
U$18  [#IO20#0]  11.43,11.29 310 top
U$19  [#IO21#0]  13.97,11.29 310 top
U$20  [#IO26#0]  16.51,11.29 310 top
U$21  [#IO33#0]  19.05,11.29 310 top
U$22  [#IO34#0]  21.59,11.29 310 top
U$23  [#IO35#0]  24.13,11.29 310 top
U$24  [#IO36#0]  26.67,11.29 310 top
U$25  [#IO38#0]  31.75,11.29 310 top
U$26  [#IO37#0]  29.21,11.29 310 top
U$27  [#IO39#0]  34.29,11.29 310 top
U$28  [#IO40#0]  36.83,11.29 310 top
U$29  [#IO41#0]  39.37,11.29 310 top
U$30  [#IO42#0]  41.91,11.29 310 top
U$31  [#IO45#0]  49.53,11.29 310 top
U$32  [#IO46#0]  52.07,11.29 310 top
U$33  [#IO17#0]  7.62,59.17 50 top
U$34  [#IO16#0]  10.16,59.17 50 top
U$35  [#IO15#0]  12.7,59.17 50 top
U$37  [#IO14#0]  15.24,59.17 50 top
U$38  [#IO13#0]  17.78,59.17 50 top
U$39  [#IO12#0]  20.32,59.17 50 top
U$40  [#IO11#0]  22.86,59.17 50 top
U$41  [#IO10#0]  25.4,59.17 50 top
U$42  [#IO9#0]  27.94,59.17 50 top
U$43  [#IO8#0]  30.48,59.17 50 top
U$44  [#IO7#0]  33.02,59.17 50 top
U$45  [#IO6#0]  35.56,59.17 50 top
U$46  [#IO5#0]  38.1,59.17 50 top
U$47  [#IO4#0]  40.64,59.17 50 top
U$48  [#IO3#0]  43.18,59.17 50 top
U$49  [#IO2#0]  45.72,59.17 50 top
U$50  [#IO1#0]  48.26,59.17 50 top
U$51  [#IO0#0]  50.8,59.17 50 top
U$57  [#IO15#0]  12.7,59.17 50 bottom
U$58  [#IO14#0]  15.24,59.17 50 bottom
U$59  [#IO13#0]  17.78,59.17 50 bottom
U$60  [#IO12#0]  20.32,59.17 50 bottom
U$65  [#IO11#0]  22.86,59.17 50 bottom
U$66  [#IO10#0]  25.4,59.17 50 bottom
U$67  [#IO9#0]  27.94,59.17 50 bottom
U$68  [#IO8#0]  30.48,59.17 50 bottom
U$69  [#IO7#0]  33.02,59.17 50 bottom
U$70  [#IO6#0]  35.56,59.17 50 bottom
U$71  [#IO5#0]  38.1,59.17 50 bottom
U$72  [#IO4#0]  40.64,59.17 50 bottom
U$73  [#IO3#0]  43.18,59.17 50 bottom
U$74  [#IO2#0]  45.72,59.17 50 bottom
U$75  [#IO1#0]  48.26,59.17 50 bottom
U$76  [#IO0#0]  50.8,59.17 50 bottom
U$77  [#IO18#0]  6.35,11.29 310 bottom
U$78  [#IO19#0]  8.86,11.29 310 bottom
U$79  [#IO20#0]  11.43,11.29 310 bottom
U$80  [#IO21#0]  13.97,11.29 310 bottom
U$81  [#IO26#0]  16.51,11.29 310 bottom
U$82  [#IO33#0]  19.05,11.29 310 bottom
U$83  [#IO34#0]  21.59,11.29 310 bottom
U$84  [#IO35#0]  24.13,11.29 310 bottom
U$85  [#IO36#0]  26.67,11.29 310 bottom
U$86  [#IO37#0]  29.21,11.29 310 bottom
U$87  [#IO38#0]  31.75,11.29 310 bottom
U$88  [#IO39#0]  34.29,11.29 310 bottom
U$89  [#IO40#0]  36.83,11.29 310 bottom
U$90  [#IO41#0]  39.37,11.29 310 bottom
U$91  [#IO42#0]  41.91,11.29 310 bottom
U$92  [#IO43#0]  44.45,11.29 310 bottom
U$93  [#IO44#0]  46.99,11.29 310 bottom
U$94  [#IO45#0]  49.53,11.29 310 bottom
U$95  [#IO46#0]  52.07,11.29 310 bottom
U$96  [#GND#0]  53.34,59.17 50 top
U$97  [#3V3#0]  55.88,59.17 50 top
U$98  [#5V#0]  54.61,11.29 310 top
U$99  [#5V#0]  54.61,11.29 310 bottom
U$100  [#GND#0]  53.34,59.17 50 bottom
U$101  [#3V3#0]  55.88,59.17 50 bottom
X1  54.61,3.83 0 top
X2  42.55,3.83 0 top
X3  30.48,3.83 0 top
X4  18.41,3.83 0 top
X5  6.34,3.83 0 top

### Tracks (layer width: path | path; a pad name or v marks a point on that pad's centre or on a via)
+3V3  (via drill 0.3)
  Top 0.508: R22.2 R23.2 | C8.1 30.75,53.69 30.57,53.52 30.57,50.94 30.77,50.75 36.8,50.75 | Q4.2 8.29,53.85 9.84,52.29 9.84,51.93 | U2.5 28.45,22.49 R23.2 | R5.2 v9.84,51.27 9.84,51.93 | R23.2 29.61,23.65 29.61,23.69 30.64,24.72 C20.1 30.64,26.09 30.26,26.47 29.01,26.47 v26.54,28.93 26.61,29 26.61,30.53 26.99,30.91 26.99,31.45 26.98,31.45 26.98,31.96 26.99,31.96 26.99,33.35 27.84,34.21 Q3.2 28.54,33.72 28.54,32.92 29.05,32.41 33.03,32.41 34.51,33.89 51.15,33.89 53.48,36.23 53.48,46.37 52.98,46.88 52.04,46.88 51.71,47.21 U1.2 51.71,51.51 C19.1 | C19.1 C18.1 48.42,50.75 36.8,50.75 | C19.1 | R4.1 36.83,50.79 36.8,50.75 | C19.1 52.48,52.28 52.99,52.28 54.48,53.77 C23.1 R8.2 55.88,55.04 GPIO2.1 | R13.2 9.87,51.9 9.84,51.93
  Bottom 0.508: v9.84,51.27 12.81,51.27 24.16,39.92 24.16,31.31 v26.54,28.93
+5V  (via drill 0.3)
  Top 0.254: J1.A4 J1.B9 | J1.A9 53.34,25.5 J1.B4 53.35,25.48
  Top 0.305: J1.B9 53.35,20.72
  Top 0.508: 53.35,20.72 v52.36,20.72 51.53,20.72 51.09,20.27 51.09,18.5 | 51.09,18.5 51.09,16.37 50.89,16.17 45.11,16.17 44.8,15.86 31.37,15.86 | GPIO1.20 54.61,16.11 52.51,18.21 51.37,18.21 51.09,18.5 | 23.08,15.86 18.95,15.86 18.48,16.34 18.48,18.17 17.87,18.78 IC1.4 17.5,19.1 Q2.1 | 23.08,15.86 31.37,15.86 | D4.A 23.56,16.33 23.08,15.86 | 53.35,25.48 v52.36,25.48 | R10.2 29.61,17.83 29.61,17.79 30.43,16.97 D5.A 31.55,16.05 31.37,15.86
  Bottom 0.508: v52.36,20.72 v52.36,25.48
BAT+  (via drill 0.3)
  Top 0.254: Q2.3 18.45,22.78 | Q5.2 15.59,49.81 15.59,49.52 13.97,47.9 R14.2
  Top 0.508: IC1.3 18.96,18.78 18.45,19.29 18.45,22.78 | R14.2 v13.94,45.86 | U$8.2 4.46,22.07 4.32,22.21 4.32,23.03 4.65,23.36 v12.9,23.36 | Q2.3 13.62,22.7 12.96,23.36 v12.9,23.36 | v12.9,23.36 11.62,24.64 C13.1
  Bottom 0.508: v12.9,23.36 13.94,24.4 v13.94,45.86
D+_CON
  Top 0.254: J1.B6 52.2,23.85 | 52.2,23.85 49.76,23.85 R18.2 | J1.A6 52.48,22.85 52.2,23.13 52.2,23.85
D-_CON
  Top 0.254: R17.2 49.76,22.35 J1.B7 54.46,22.35 54.64,22.53 54.64,23.1 54.39,23.35 J1.A7
EN  (via drill 0.3)
  Top 0.254: U1.41 51.71,32.66 v51.72,32.87 | RST.A' v56.98,14.53 RST.A | R8.1 v58.45,51.87 | v58.45,51.87 | C17.1 v58.45,51.87
  Bottom 0.254: v56.98,14.53 55.52,15.99 54.1,15.99 52.96,17.13 52.96,29.04 51.72,30.28 v51.72,32.87 51.72,34.66 53.61,36.55 53.61,51.09 54.39,51.87 v58.45,51.87
GND  (via drill 0.3)
  Top 0.254: J1.S1 53.49,19.69 J1.A1 | J1.S2 53.49,26.5 J1.B1
  other vias: 34.51,16.57 37.69,24.43 34.2,34.9 50.8,11.96 40.67,11.86 42.1,20.12 33.4,17.82 37.47,32.87 21.14,30.82 41.98,46.25 50.39,45.9 15.78,45.83 35.99,44.42 45.86,63.06 24.41,26.79 24.32,21.54 38.97,32.87 40.41,32.87 41.91,32.87 25.31,46.26 0.49,8.49 0.49,16.34 0.49,25.85 0.49,29.97 0.49,34.48 0.49,37.5 0.49,42.5 0.49,47.5 0.49,52.5 1.97,59.34 0.77,62.81 0.49,67.5 1.74,72.5 1.74,77.5 1.74,82.5 0.49,87.5 0.49,92.5 0.49,97.5 5.49,100.02 10.49,100.02 15.49,100.02 20.49,100.02 25.49,100.02 30.49,100.02 35.49,100.02 40.49,100.02 45.49,100.02 50.49,100.02 55.49,100.02 60.49,97.5 60.49,92.5 60.49,82.5 60.49,87.5 60.49,77.5 60.49,72.5 60.49,67.5 60.49,62.5 52.71,43.93 53.41,35.02 52.84,38.88 53.25,30.08 60.49,27.5 60.49,22.5 60.49,17.5 60.46,10.4 2.99,37.5 2.99,34.48 4,36.02 45.5,15.35 43.15,15.23 44.93,32.86 29.3,16.88
  pour Top (rank 6): -1.27,-1.25 63.5,-1.25 63.5,104.35 -1.27,104.35
  pour Bottom (rank 6): 64.77,-2.52 -2.54,-2.52 -2.54,105.62 64.77,105.62
IO0  (via drill 0.3)
  Top 0.254: BOOT.A v3.98,14.65 BOOT.A' | v33.93,44.02 35.64,45.74 49.53,45.74 50.21,46.42 U1.3 50.21,49.98 v50.23,49.99
  Bottom 0.254: v50.23,49.99 50.23,56.06 GPIO2.3 | v33.93,44.02 31.45,41.55 28.32,41.55 27.65,40.88 27.65,33.61 28.16,33.1 28.16,27.11 28.86,26.41 28.86,23.61 24.61,19.35 6.73,19.35 3.98,16.6 v3.98,14.65
IO1  (via drill 0.3)
  Top 0.254: v51.88,16.75 52.7,16.75 53.34,16.11 53.34,11.57 54.61,10.3 X1.P$1 | U1.4 48.71,49.98 v48.7,49.99
  Bottom 0.254: GPIO2.4 48.26,50.53 v48.7,49.99 50.99,47.71 50.99,17.64 v51.88,16.75
IO2  (via drill 0.3)
  Top 0.254: X2.P$1 42.55,9.96 43.47,10.88 47.78,10.88 v48.35,11.45 | U1.5 v47.21,49.99 | v47.21,49.99
  Bottom 0.254: GPIO2.5 45.72,51.55 v47.21,49.99 47.21,44.37 47.69,43.9 47.69,33.61 47.85,33.45 47.85,32.67 47.62,32.45 47.62,15.43 48.26,14.8 48.26,11.54 v48.35,11.45
IO3  (via drill 0.3)
  Top 0.254: X3.P$1 30.48,9.54 31.84,10.91 34.83,10.91 35.55,11.63 v35.55,11.96 | U1.6 v45.71,49.98 v45.72,49.99
  Bottom 0.254: GPIO2.6 43.18,52.79 v45.72,49.99 45.72,45.33 47.31,43.74 47.31,33.61 46.83,33.13 46.83,15.89 45.7,14.76 45.7,11.68 45.34,11.32 36.19,11.32 v35.55,11.96
IO4  (via drill 0.3)
  Top 0.254: v27.94,14.97 27.94,11.29 26.98,10.33 19.2,10.33 18.41,9.54 X4.P$1 | U1.7 44.21,49.98 v44.23,49.99
  Bottom 0.254: GPIO2.7 40.64,53.69 41.08,53.25 v44.23,49.99 44.23,46.34 35.88,37.99 35.88,21.54 29.88,15.54 28.51,15.54 v27.94,14.97
IO5  (via drill 0.3)
  Top 0.254: X5.P$1 6.34,9.06 8.19,10.91 17.02,10.91 17.78,11.67 v17.78,15.77 | U1.8 42.71,49.98 v42.7,49.99
  Bottom 0.254: GPIO2.8 38.1,54.66 v42.7,49.99 42.7,45.45 31.18,33.93 31.18,22.65 25.53,17 18.57,17 17.78,16.21 v17.78,15.77
IO6  (via drill 0.3)
  Top 0.254: R31.2 R30.1 | R30.1 | R30.1 19.62,24.88 20.61,25.86 21.97,25.86 26.1,29.99 26.1,33.32 26.7,33.92 26.7,34.56 27.32,35.18 27.92,35.18 28.25,35.51 31.49,35.51 v31.56,35.58 | v41.24,47.01 41.21,47.04 U1.9 41.21,49.96 v41.24,49.99
  Bottom 0.254: v41.24,49.99 35.56,55.74 GPIO2.9 | v31.56,35.58 32.29,35.58 41.24,44.53 v41.24,47.01
IO7  (via drill 0.3)
  Top 0.254: U1.10 v39.71,49.98 v39.72,49.99
  Bottom 0.254: v39.72,49.99 35.56,54.25 33.5,54.25 33.02,54.72 GPIO2.10
IO8_SDA  (via drill 0.3)
  Top 0.254: v33.18,34.47 33.18,36.91 v33.05,37.04 | R22.1 31.93,19.46 v32.28,19.46 | U1.11 38.21,49.98 v38.23,49.99
  Bottom 0.254: v38.23,49.99 38.21,50.01 | 38.21,50.01 34.54,53.74 30.67,53.74 30.48,53.93 GPIO2.11 | 38.21,50.01 38.21,42.13 33.12,37.04 v33.05,37.04 | v32.28,19.46 34.52,21.69 34.52,25.11 33.91,25.72 33.91,33.74 v33.18,34.47
IO9_SCL  (via drill 0.3)
  Top 0.254: v32.54,36.63 32.64,36.53 32.64,33.22 v32.8,33.06 | U1.12 36.71,49.98 v36.7,49.99 | R23.1 32.16,21.26 v32.16,20.13
  Bottom 0.254: GPIO2.12 27.94,53.55 28.45,53.04 33.75,53.04 v36.7,49.99 36.7,41.8 32.54,37.64 v32.54,36.63 | v32.16,20.13 32.93,20.9 32.93,21.93 33.46,22.46 33.46,32.41 v32.8,33.06
IO10  (via drill 0.3)
  Top 0.254: U1.13 35.18,48.77 v35.18,49.99
  Bottom 0.254: v35.18,49.99 32.96,52.28 26.15,52.28 25.4,53.03 GPIO2.13
IO11  (via drill 0.3)
  Top 0.254: U1.14 v33.71,49.99 v33.72,49.99
  Bottom 0.254: v33.72,49.99 32.29,51.42 23.61,51.42 22.86,52.17 GPIO2.14
IO12  (via drill 0.3)
  Top 0.254: U1.15 32.23,48.75 v32.23,49.99
  Bottom 0.254: v32.23,49.99 31.5,50.72 21.87,50.72 20.32,52.27 GPIO2.15
IO13  (via drill 0.3)
  Top 0.254: U1.16 30.71,49.97 v30.73,49.99
  Bottom 0.254: v30.73,49.99 21.27,49.99 17.78,53.48 GPIO2.16
IO14  (via drill 0.3)
  Top 0.254: v31.08,46.75 31.06,46.74 U1.17 | C21.2 v11.87,45.83 | v15.18,45.83 15.18,48.12 15.72,48.66 v21.21,48.66
  Bottom 0.254: v11.87,45.83 11.87,46.36 12.3,46.79 14.72,46.79 15.18,46.33 v15.18,45.83 | v31.08,46.75 23.13,46.75 v21.21,48.66 15.24,54.64 GPIO2.17
IO15  (via drill 0.3)
  Top 0.254: v31.08,45.23 31.07,45.24 U1.18
  Bottom 0.254: v31.08,45.23 23.97,45.23 14.32,54.88 12.95,54.88 12.7,55.14 GPIO2.18
IO16  (via drill 0.3)
  Top 0.254: U1.19 28.86,43.74 v28.83,43.71 | Q4.1 9.65,56.12 GPIO2.19
  Top 0.508: Q4.1 11.82,53.85 R13.1
  Bottom 0.254: v28.83,43.71 24.96,43.71 14.16,54.5 10.79,54.5 10.16,55.14 GPIO2.19
IO17  (via drill 0.3)
  Top 0.254: U1.20 v28.83,42.24
  Bottom 0.254: v28.83,42.24 25.88,42.24 14.04,54.09 8.22,54.09 7.62,54.69 GPIO2.20
IO18  (via drill 0.3)
  Top 0.254: U1.21 29.94,40.72 v28.77,40.72 40.7,40.72 43.43,37.99 v43.43,34.94 | v43.42,32.89 43.42,27.01 44.16,26.27 LED2.4-DIN
  Bottom 0.254: v43.43,34.94 43.43,32.9 v43.42,32.89 | GPIO1.1 6.35,17.04 8.29,18.97 24.77,18.97 29.24,23.45 29.24,26.57 28.57,27.24 28.57,33.23 28.04,33.77 28.04,40.34 28.42,40.72 v28.77,40.72
IO19  (via drill 0.3)
  Top 0.254: R17.1 46.4,22.08 46.07,22.48 46.07,29.93 v45.91,30.08 | v39.81,39.25 39.79,39.24 U1.22 29.94,39.26 v28.83,39.26
  Bottom 0.254: v28.83,39.26 29.3,39.26 29.62,38.94 29.62,23.29 24.9,18.56 11.11,18.56 8.89,16.34 GPIO1.2 | v45.91,30.08 46.04,30.21 46.04,35.29 42.08,39.25 v39.81,39.25
IO20  (via drill 0.3)
  Top 0.254: v31.08,37.74 U1.23 v40,37.74 v40.01,37.74 | R18.1 46.58,24.12 46.45,24.24 46.45,32.75 45.94,33.26 v45.53,33.26
  Bottom 0.254: v31.08,37.74 31.08,37.01 30,35.93 30,23.13 25.05,18.18 13.49,18.18 11.43,16.11 GPIO1.3 | v40.01,37.74 42.16,37.74 45.53,34.37 v45.53,33.26
IO21  (via drill 0.3)
  Top 0.254: v31.08,36.24 U1.24 28.41,36.24 27.78,35.61 25.94,35.61 | R5.1 9.84,45.74 10.26,45.32 16.33,45.32 16.49,45.48 v16.49,45.83 | v23.18,39.48 23.18,39.24 25.94,36.48 25.94,35.61 | Q3.1 25.94,35.61
  Bottom 0.254: v31.08,36.24 30.92,36.24 30.42,35.74 30.42,23 25.21,17.8 15.24,17.8 13.97,16.53 GPIO1.4 | v23.18,39.48 23.18,39.65 17.61,45.22 16.81,45.22 16.49,45.54 v16.49,45.83
IO26  (via drill 0.3)
  Top 0.254: U1.25 31.17,34.74 v31.21,34.78
  Bottom 0.254: GPIO1.5 16.51,16.31 17.59,17.38 25.37,17.38 30.8,22.81 30.8,34.37 v31.21,34.78
IO33  (via drill 0.3)
  Top 0.254: U1.27 30.71,30.3 30.89,30.12 v31.69,30.12
  Bottom 0.254: GPIO1.6 19.05,16.18 19.48,16.61 25.67,16.61 31.56,22.5 31.56,29.99 v31.69,30.12
IO34  (via drill 0.3)
  Top 0.254: U1.28 32.21,30.19 v32.29,30.12
  Bottom 0.254: GPIO1.7 21.59,15.61 22.19,16.21 25.85,16.21 31.94,22.3 31.94,29.67 32.29,30.02 v32.29,30.12
IO35_MOSI  (via drill 0.3)
  Top 0.254: U1.29 33.71,30.94 v32.89,30.12 32.89,29.86 32.66,29.63 30.2,29.63 29.34,30.48 29.34,31.36 27.81,32.9 v27.65,32.9
  Bottom 0.254: v27.65,32.9 27.27,33.28 27.27,40.31 13.88,53.71 7.92,53.71 6.25,55.38 6.25,77.77 6.48,78 U$1.14 | v32.89,30.12 32.89,30.02 32.32,29.45 32.32,22.15 24.13,13.96 GPIO1.8
IO36_SCK  (via drill 0.3)
  Top 0.254: v35.21,32.87 U1.30 35.21,30.98 33.41,29.18 30.08,29.18 28.93,30.34 28.93,31.24 27.85,32.31 v27.63,32.31 v27.62,32.31
  Bottom 0.254: v27.62,32.31 27.3,32.31 26.89,32.72 26.89,40.15 13.72,53.33 7.77,53.33 5.87,55.22 5.87,77.99 6.38,78.5 U$1.13 | GPIO1.9 26.67,14.4 28.19,15.92 29.72,15.92 35.5,21.7 35.5,32.59 v35.21,32.87
IO37  (via drill 0.3)
  Top 0.254: U1.31 36.71,32.86 v36.7,32.87
  Bottom 0.254: GPIO1.10 29.21,14.34 36.7,21.83 v36.7,32.87
IO38  (via drill 0.3)
  Top 0.254: U1.32 38.21,32.85 v38.2,32.87 | C15.1 v38.29,28.82 v38.29,28.81 R9.2
  Bottom 0.254: v38.2,32.87 38.29,32.78 v38.29,28.82 38.29,21.58 31.75,15.04 GPIO1.11
IO39_RST  (via drill 0.3)
  Top 0.254: U1.33 v39.71,32.86 v39.72,32.87 | v39.72,22.05 36.86,22.05 34.65,24.27 33.77,24.27 31.01,27.02 29.18,27.02 27.11,29.08 27.11,30.24 27.37,30.5 v27.63,30.5
  Bottom 0.254: v39.72,32.87 v39.72,22.05 39.72,20.69 34.29,15.26 GPIO1.12 | v27.63,30.5 27.26,30.5 25.72,32.04 25.72,39.68 13.21,52.18 7.29,52.18 4.73,54.74 4.73,78.47 6.26,80 U$1.10
IO40_DC  (via drill 0.3, 0.35)
  Top 0.254: v41.21,32.87 U1.34 41.24,31.21 41.24,30.24 41.05,30.05 v37.78,30.05 | v41.21,32.87 | v27.62,31.1 27.98,31.1 28.17,30.92 28.17,30.02 29.77,28.42 33.44,28.42 34.59,27.27 v37.5,27.27
  Bottom 0.254: GPIO1.13 38.1,14.91 41.24,18.05 41.24,32.84 v41.21,32.87 | U$1.11 6.3,79.5 5.11,78.31 5.11,54.9 7.45,52.56 13.37,52.56 26.1,39.84 26.1,32.28 27.27,31.1 v27.62,31.1 | v37.5,27.27 37.5,29.77 v37.78,30.05
IO41_CS  (via drill 0.3)
  Top 0.254: v42.67,32.87 42.71,32.83 U1.35 42.71,28.09 42.39,27.77 34.62,27.77 33.6,28.8 29.93,28.8 28.55,30.18 28.55,31.08 27.92,31.71 v27.59,31.71 v27.59,31.7
  Bottom 0.254: GPIO1.14 39.37,14.4 42.67,17.7 v42.67,32.87 | U$1.12 6.34,79 5.49,78.15 5.49,55.06 7.61,52.94 13.53,52.94 26.48,39.99 26.48,32.51 27.29,31.7 v27.59,31.7
IO42_BUSY  (via drill 0.3)
  Top 0.254: v34.42,32.69 34.42,33.04 34.77,33.39 43.94,33.39 44.23,33.1 v44.23,32.87 44.21,32.86 U1.36 | v27.62,29.91 27.73,29.91 29.61,28.04 33.23,28.04 34.51,26.75 v34.51,26.6
  Bottom 0.254: v27.62,29.91 27.25,29.91 25.34,31.83 25.34,39.49 13.03,51.8 7.13,51.8 4.35,54.59 4.35,78.63 6.22,80.5 U$1.9 | GPIO1.15 41.91,15.26 44.55,17.89 44.55,32.56 v44.23,32.87 | v34.42,32.69 34.42,26.69 v34.51,26.6
IO43  (via drill 0.3)
  Top 0.254: U1.37 45.71,32.21 v45.53,32.4
  Bottom 0.254: GPIO1.16 44.45,17.23 45.4,18.18 45.4,32.27 v45.53,32.4
IO44  (via drill 0.3)
  Top 0.254: U1.38 47.21,32.71 v47.37,32.87
  Bottom 0.254: GPIO1.17 47.24,13.7 47.24,32.75 v47.37,32.87
IO45  (via drill 0.3)
  Top 0.254: U1.39 48.71,32.87 v48.7,32.87
  Bottom 0.254: v48.7,32.87 48.7,16.81 49.53,15.99 GPIO1.18
IO46  (via drill 0.3)
  Top 0.254: U1.40 50.2,31.26 v50.2,32.87
  Bottom 0.254: v50.2,32.87 50.2,17.35 52.07,15.48 GPIO1.19
N$1  (via drill 0.3)
  Top 0.254: C1.1 13.94,64.95 v13.97,64.98
  Bottom 0.254: U$1.24 13.38,73 13.94,72.44 13.94,65.01 v13.97,64.98
N$2  (via drill 0.3)
  Top 0.254: D2.A 18.8,50.14 17.78,51.16 17.78,52.42 C2.1 v16.51,64.98
  Bottom 0.254: v16.51,64.98 16.51,72.22 15.23,73.5 U$1.23
N$3  (via drill 0.3)
  Top 0.254: C3.1 v19.05,64.98
  Bottom 0.254: v19.05,64.98 19.05,72.41 17.46,74 U$1.22
N$4  (via drill 0.3)
  Top 0.254: v21.59,64.98 C4.1 22.67,52.69 22.67,51.09 21.71,50.14 D1.C
  Bottom 0.254: v21.59,64.98 21.59,72.34 19.44,74.5 U$1.21
N$5  (via drill 0.3)
  Top 0.254: C5.1 v24.13,64.98
  Bottom 0.254: v24.13,64.98 24.13,72.47 21.6,75 U$1.20
N$6  (via drill 0.3)
  Top 0.254: C6.1 v26.67,64.98
  Bottom 0.254: v26.67,64.98 26.67,72.47 23.64,75.5 U$1.19
N$7  (via drill 0.3)
  Top 0.254: C11.1 v29.21,64.98
  Bottom 0.254: v29.21,64.98 29.21,72.47 25.68,76 U$1.18
N$8
  Top 0.254: IC1.1 21.02,16.88 22.84,18.7 R6.2
N$9  (via drill 0.3)
  Top 0.254: PWR.2 4.58,59.23 4.38,59.42 v3.78,59.42 | U2.1 20.13,22.49 19.4,21.76 Q2.2 19.4,20.05 19.68,19.77 27.24,19.77 27.75,19.25 D5.C | U2.1 23.31,24.46 C14.1 | U2.1 24.32,22.49 v24.36,22.46
  Bottom 0.254: v24.36,22.46 24.83,21.99 24.83,20.38 24.53,20.09 24.11,20.09 23.99,20.21 8.35,20.21 6.35,22.21 6.35,39.39 2,43.74 2,58.28 3.14,59.42 v3.78,59.42
N$10  (via drill 0.3)
  Top 0.254: v52.01,45.36 36.23,45.36 33.81,42.94 28.05,42.94 Q1.2 | R2.1 v44.45,64.98
  Bottom 0.254: v52.01,45.36 52.01,58.72 51.69,59.04 45.81,59.04 44.45,60.41 v44.45,64.98 44.45,72.44 33.39,83.5 U$1.3
N$11  (via drill 0.3)
  Top 0.254: C9.1 v39.37,64.98
  Bottom 0.254: v39.37,64.98 39.37,72.47 29.34,82.5 U$1.5
N$12  (via drill 0.3)
  Top 0.254: C7.1 v41.91,64.98
  Bottom 0.254: v41.91,64.98 41.91,72.47 31.38,83 U$1.4
N$13  (via drill 0.3)
  Top 0.254: v52.7,44.56 41.62,44.56 38.58,41.51 26.38,41.51 26.24,41.66 Q1.1 | R1.1 v46.99,64.98
  Bottom 0.254: v52.7,44.56 52.7,52.63 54.64,54.56 54.64,58.6 53.82,59.42 48.32,59.42 46.99,60.75 v46.99,64.98 46.99,72.44 35.43,84 U$1.2
N$14
  Bottom 0.254: 55.5,3.02 55.5,0.02
N$15
  Top 0.254: D4.C 25.66,18.6 R6.1
N$16
  Top 0.508: C10.1 26.67,49.36 25.89,50.14 D3.A 24.23,50.04 24.23,48.31 23.97,48.06 19.4,48.06 19.05,47.71 D2.C
N$17
  Top 0.254: LED2.2-DOUT 38.3,24.84 LED3.4-DIN
N$18  (via drill 0.3)
  Top 0.254: v2.51,56.44 2.73,56.44 3.14,56.85 PWR.1 | v24.32,20.59 U2.3
  Bottom 0.254: v2.51,56.44 2.41,56.34 2.41,43.86 6.76,39.51 6.76,22.34 8.51,20.59 v24.32,20.59
N$19
  Top 0.254: C10.2 26.89,46.57
  Top 0.508: 26.89,46.57 Q1.3 | L1.2 3.58,47.85 6.61,44.81 21.59,44.81 | 21.59,44.81 24.77,44.81 26.67,46.71 C10.2 | D1.A 21.59,44.81
N$20
  Top 0.254: RATE1.1 13.43,22.18 13.56,22.05 R11.1
N$21
  Top 0.254: RATE2.1 11.66,19 R12.1
N$22
  Top 0.254: LED4.2-DOUT 35.01,18.65 42.61,18.65 44.26,20.3 LED5.4-DIN
N$23
  Top 0.254: J1.B5 50.79,24.85 R15.2
N$24
  Top 0.254: J1.A5 51.32,21.85 R16.2
N$25
  Top 0.254: LED4.4-DIN 38.01,20.3 35.34,22.97 LED3.2-DOUT
N$27  (via drill 0.3)
  Top 0.508: R19.2 8.7,50.68 Q4.3 6.59,51.85 5.94,52.49 5.94,76.22 6.95,77.23 v11.02,77.23
  pour Bottom (no thermals): 12.29,76.88 10.7,76.88 10.7,77.61 12.29,77.61
N$28
  Bottom 0.254: 54.5,2.02 54.5,0.02
N$29
  Bottom 0.254: 53.5,2.02 53.5,0.02
N$30
  Bottom 0.254: 52.5,2.02 52.5,0.02
N$31
  Bottom 0.254: 51.5,2.02 51.5,0.02
N$32
  Bottom 0.254: 50.5,2.02 50.5,0.02
N$33
  Bottom 0.254: 49.5,2.02 49.5,0.02
N$34
  Bottom 0.254: 48.5,2.02 48.5,0.02
N$35
  Bottom 0.254: 47.5,2.02 47.5,0.02
N$36
  Bottom 0.254: 46.5,2.02 46.5,0.02
N$37
  Bottom 0.254: 45.5,3.02 45.5,0.02
N$38
  Bottom 0.254: 44.5,2.02 44.5,0.02
N$39
  Bottom 0.254: 43.5,2.02 43.5,0.02
N$40
  Bottom 0.254: 42.5,2.02 42.5,0.02
N$41
  Bottom 0.254: 41.5,2.02 41.5,0.02
N$42
  Bottom 0.254: 40.5,2.02 40.5,0.02
N$43
  Bottom 0.254: 39.5,2.02 39.5,0.02
N$44
  Bottom 0.254: 38.5,2.02 38.5,0.02
N$45
  Bottom 0.254: 37.5,2.02 37.5,0.02
N$46
  Bottom 0.254: 36.5,2.02 36.5,0.02
N$47
  Bottom 0.254: 35.5,3.02 35.5,0.02
N$48
  Bottom 0.254: 34.5,2.02 34.5,0.02
N$49
  Bottom 0.254: 33.5,2.02 33.5,0.02
N$50
  Bottom 0.254: 32.5,2.02 32.5,0.02
N$51
  Bottom 0.254: 31.5,2.02 31.5,0.02
N$52
  Bottom 0.254: 30.5,2.02 30.5,0.02
N$53
  Bottom 0.254: 29.5,2.02 29.5,0.02
N$54
  Bottom 0.254: 28.5,2.02 28.5,0.02
N$55
  Bottom 0.254: 27.5,2.02 27.5,0.02
N$56
  Bottom 0.254: 26.5,2.02 26.5,0.02
N$57
  Bottom 0.254: 25.5,3.02 25.5,0.02
N$58
  Bottom 0.254: 24.5,2.02 24.5,0.02
N$59
  Bottom 0.254: 23.5,2.02 23.5,0.02
N$60
  Bottom 0.254: 22.5,2.02 22.5,0.02
N$61
  Bottom 0.254: 21.5,2.02 21.5,0.02
N$62
  Bottom 0.254: 20.5,2.02 20.5,0.02
N$63
  Bottom 0.254: 19.5,2.02 19.5,0.02
N$64
  Bottom 0.254: 18.5,2.02 18.5,0.02
N$65
  Bottom 0.254: 17.5,2.02 17.5,0.02
N$66
  Bottom 0.254: 16.5,2.02 16.5,0.02
N$67
  Bottom 0.254: 15.5,3.02 15.5,0.02
N$68
  Bottom 0.254: 14.5,2.02 14.5,0.02
N$69
  Bottom 0.254: 13.5,2.02 13.5,0.02
N$70
  Bottom 0.254: 12.5,2.02 12.5,0.02
N$71
  Bottom 0.254: 11.5,2.02 11.5,0.02
N$72
  Bottom 0.254: 10.5,2.02 10.5,0.02
N$73
  Bottom 0.254: 9.5,2.02 9.5,0.02
N$74
  Bottom 0.254: 8.5,2.02 8.5,0.02
N$75
  Bottom 0.254: 7.5,2.02 7.5,0.02
N$76
  Bottom 0.254: 6.5,2.02 6.5,0.02
N$77
  Bottom 0.254: 5.5,3.02 5.5,0.02
N$78
  Top 0.508: R19.1 6.95,48.77 6.91,48.77 5.88,49.8 C12.1 3.73,51.85 L1.1
N$79  (via drill 0.3)
  Top 0.254: Q5.3 16.52,46.89 17.07,46.34 v17.07,45.83 | v25.7,28.89 25.54,28.89 21.94,25.29 21.94,25.23 R30.2
  Bottom 0.254: v25.7,28.89 23.66,30.93 23.66,39.71 17.53,45.83 v17.07,45.83
N$80
  Top 0.254: Q5.1 17.47,50.05 16.83,50.69 15.06,50.69 14.16,49.8 R14.1 C21.1
P8  (via drill 0.3)
  Top 0.254: R3.2 34.29,54.09 | 34.29,54.09 v34.29,64.98 | R4.2 34.71,53.67 34.29,54.09
  Bottom 0.254: v34.29,64.98 34.29,72.47 25.76,81 U$1.8
PROG
  Top 0.254: RATE1.2 10.92,20.15 10.16,19.38 10.16,17.3 10.44,17.02 10.91,17.02 RATE2.2 11.3,16.08 11.65,15.73 15.27,15.73 15.46,15.92 R7.1 15.55,16.88 IC1.5
V+  (via drill 0.3)
  Top 0.508: LED2.1-VDD 41.24,26.27 41.53,25.99 41.53,22.12 | 41.53,22.12 41.53,20.69 41.15,20.3 LED5.1-VDD 40.16,19.44 39.97,19.26 33.59,19.26 33.36,19.49 LED4.1-VDD 33.46,20.4 v33.46,21.67 | 41.53,22.12 41.97,21.67 45.53,21.67 46.32,20.88 46.32,18.56 46.9,17.99 C16.1 | Q3.3 C22.1 25.14,38.09 24.8,38.43 v24.8,39.23 | v33.98,24.77 33.4,25.36 LED3.1-VDD 33.2,26.27 31.95,27.53 29.4,27.53 27.64,29.29 v27.62,29.29
  Bottom 0.508: v24.8,39.23 24.8,31.63 27.14,29.29 v27.62,29.29 | v33.46,21.67 33.98,22.19 v33.98,24.77

### Text on the board
Bottom: 50 | 40 | 30 | 20 | 10 | 0 | mm
tPlace: Maker badge | If you can read this, it means / you are a very curious maker. / / Keep tinkering! | JLCJLCJLCJLC | Powered by idea! | + | -
bPlace: Connect board via USB and program / it using CircuitPython or Arduino. | Based on idea by Luboš Moravec (@Bastlir) | More info & / code examples | Designed by | github.com/ / makerfaireczech/ / maker_badge
bStop: 50 | 40 | 30 | 20 | 10 | 0 | mm